# Altium schematic sheet Buck Boost 19V.SchDoc
size Tabloid; Date: Date; Author: Author 1; DocumentNumber: 7; Revision: 1; SheetNumber: 7; SheetTotal: 7; Size: 11x17; Sheet_Name: Boost 19V
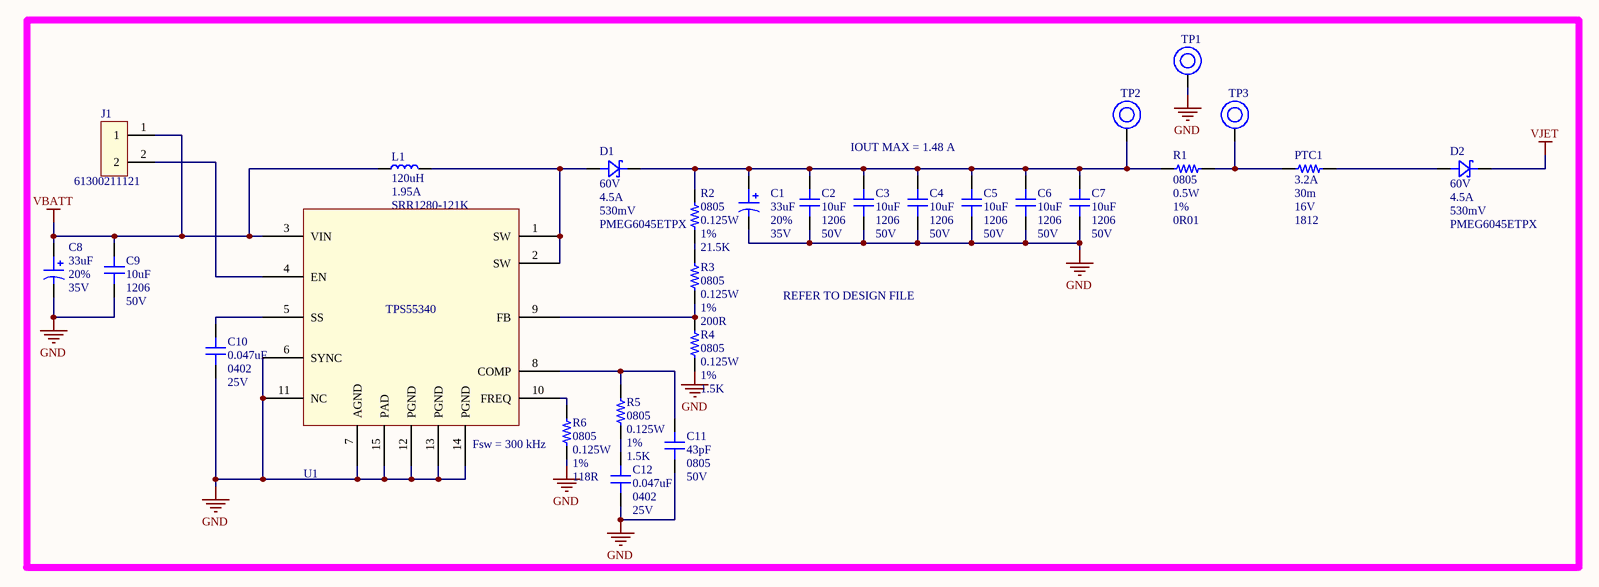
[diagram p0: Buck Boost 19V.SchDoc]

## Parts
C1  value 33uF  Tolerance: 20%  Voltage: 35V  [CAP ALU - 6.3mm DIA]  (hidden comment: CAP_EEE-FK1V330P)
C2  value 10uF  Package: 1206  Voltage: 50V  [CAP_1206]  (hidden comment: CAP_GRT31CR61H106ME01L‎)
C3  value 10uF  Package: 1206  Voltage: 50V  [CAP_1206]  (hidden comment: CAP_GRT31CR61H106ME01L‎)
C4  value 10uF  Package: 1206  Voltage: 50V  [CAP_1206]  (hidden comment: CAP_GRT31CR61H106ME01L‎)
C5  value 10uF  Package: 1206  Voltage: 50V  [CAP_1206]  (hidden comment: CAP_GRT31CR61H106ME01L‎)
C6  value 10uF  Package: 1206  Voltage: 50V  [CAP_1206]  (hidden comment: CAP_GRT31CR61H106ME01L‎)
C7  value 10uF  Package: 1206  Voltage: 50V  [CAP_1206]  (hidden comment: CAP_GRT31CR61H106ME01L‎)
C8  value 33uF  Tolerance: 20%  Voltage: 35V  [CAP ALU - 6.3mm DIA]  (hidden comment: CAP_EEE-FK1V330P)
C9  value 10uF  Package: 1206  Voltage: 50V  [CAP_1206]  (hidden comment: CAP_GRT31CR61H106ME01L‎)
C10  value 0.047uF  Package: 0402  Voltage: 25V  [CAP_0402]  (hidden comment: CAP_‎‎‎C0402C473K3RACAUTO‎)
C11  value 43pF  Package: 0805  Voltage: 50V  [CAP_0805]  (hidden comment: CAP_‎‎‎C0805C430J5GAC7800)
C12  value 0.047uF  Package: 0402  Voltage: 25V  [CAP_0402]  (hidden comment: CAP_‎‎‎C0402C473K3RACAUTO‎)
D1  Voltage: 60V  Current: 4.5A  Vf: 530mV  Part number: PMEG6045ETPX  [DO-214AC_SOD128]  (hidden comment: DIODE_SCH_PMEG6045ETPX)
D2  Voltage: 60V  Current: 4.5A  Vf: 530mV  Part number: PMEG6045ETPX  [DO-214AC_SOD128]  (hidden comment: DIODE_SCH_PMEG6045ETPX)
J1  Part number: 61300211121  [HDR1X2]  (hidden comment: Header 2 pin SM)
L1  value 120uH  Current: 1.95A  Part number: SRR1280-121K  [BOURNS 12.5x12.5mm]  (hidden comment: IND_SRR1280-121K)
PTC1  Trip value: 3.2A  Res: 30m  Voltage: 16V  Package: 1812  [PTC - 1812]  (hidden comment: PTC_0ZCG0160BF2C)
R1  value 0R01  Package: 0805  Power: 0.5W  Tolerance: 1%  [RES_0805]  (hidden comment: RES_‎‎‎‎‎ KRL1220E-M-R010-F-T5)
R2  value 21.5K  Package: 0805  Power: 0.125W  Tolerance: 1%  [RES_0805]  (hidden comment: RES_‎ERJ-6ENF2152V)
R3  value 200R  Package: 0805  Power: 0.125W  Tolerance: 1%  [RES_0805]  (hidden comment: RES_‎‎CRCW0805200RFKEA‎)
R4  value 1.5K  Package: 0805  Power: 0.125W  Tolerance: 1%  [RES_0805]  (hidden comment: RES_‎‎‎‎CRCW08051K50FKEAC)
R5  value 1.5K  Package: 0805  Power: 0.125W  Tolerance: 1%  [RES_0805]  (hidden comment: RES_‎‎‎‎CRCW08051K50FKEAC)
R6  value 118R  Package: 0805  Power: 0.125W  Tolerance: 1%  [RES_0805]  (hidden comment: RES_‎‎‎CRCW0805118KFKEA)
TP1  TestPoint 3x3mm  [TestPoint 3X3mm]  (value not drawn)
TP2  TestPoint 3x3mm  [TestPoint 3X3mm]  (value not drawn)
TP3  TestPoint 3x3mm  [TestPoint 3X3mm]  (value not drawn)
U1  REG_BOOST_PS55340  [14-TSSOP]  (value not drawn)

## Nets
GND: C1.2 C2.2 C3.2 C4.2 C5.2 C6.2 C7.2 C8.2 C9.2 C10.2 C11.2 C12.2 R4.2 R6.2 TP1.1 U1.6(SYNC) U1.7(AGND) U1.11(NC) U1.12(PGND) U1.13(PGND) U1.14(PGND) U1.15(PAD)
VBATT: C8.1 C9.1 J1.1 L1.1 U1.3(VIN)
VJET: D2.2
NetC1_1: C1.1 C2.1 C3.1 C4.1 C5.1 C6.1 C7.1 D1.2 R1.1 R2.1 TP2.1
NetC10_1: C10.1 U1.5(SS)
NetC11_1: C11.1 R5.1 U1.8(COMP)
NetC12_1: C12.1 R5.2
NetD1_1: D1.1 L1.2 U1.1(SW) U1.2(SW)
NetD2_1: D2.1 PTC1.2
NetJ1_2: J1.2 U1.4(EN)
NetPTC1_1: PTC1.1 R1.2 TP3.1
NetR2_2: R2.2 R3.1
NetR3_2: R3.2 R4.1 U1.9(FB)
NetR6_1: R6.1 U1.10(FREQ)

## Notes on the sheet
- IOUT MAX = 1.48 A
- REFER TO DESIGN FILE
- Fsw = 300 kHz
- Sheet Name
- Project Title
- Global Project
- Size
- Group
- Revision
- Date
- Sheet
- of
- Filename
- Designers

## Library data of the parts
C1 C8 = CAP_EEE-FK1V330P: CAP ALU 33µF 35V; Part number: EEE-FK1V330P; Package: 6.30mm
C2-C7 C9 = CAP_GRT31CR61H106ME01L‎: CAP CER 10uF 50V 1206; Part number: GRT31CR61H106ME01L‎
C10 C12 = CAP_‎‎‎C0402C473K3RACAUTO‎: CAP CER 0.047uF 25V 0402; Part number: ‎C0402C473K3RACAUTO‎
C11 = CAP_‎‎‎C0805C430J5GAC7800: CAP CER 43pF 50V 0805; Tolerance: 5%; Part number: C0805C430J5GAC7800
D1 D2 = DIODE_SCH_PMEG6045ETPX: Diode Schottky 60V 4.5A Surface Mount CFP5; Package: SOD-128
L1 = IND_SRR1280-121K: IND 120µH Shielded Wirewound Inductor 1.95A; Tolerance: 20%; Package: Nonstandard
PTC1 = PTC_0ZCG0160BF2C: PTC_Polymeric PTC Resettable Fuse 16V 1.6A Ih; Part number: 0ZCG0160BF2C
R1 = RES_‎‎‎‎‎ KRL1220E-M-R010-F-T5: RES 0.01R 1% 1/2W 0805; Part number: KRL1220E-M-R010-F-T5
R2 = RES_‎ERJ-6ENF2152V: RES 21.5K 1% 1/8W 0805; Part number: ‎ERJ-6ENF2152V
R3 = RES_‎‎CRCW0805200RFKEA‎: RES 200R 1% 1/8W 0805; Part number: CRCW0805200RFKEA‎
R4 R5 = RES_‎‎‎‎CRCW08051K50FKEAC: RES 1.5K 1% 1/8W 0805; Part number: CRCW08051K50FKEAC
R6 = RES_‎‎‎CRCW0805118KFKEA: RES 118R 1% 1/8W 0805; Part number: CRCW0805118KFKEA
U1 = REG_BOOST_PS55340: Part number: TPS55340